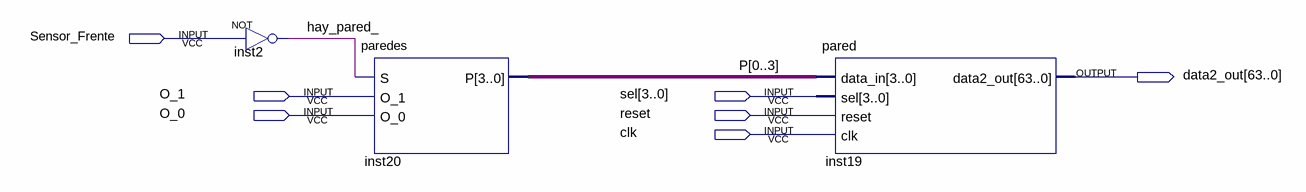
[diagram p0: schematic sheet]
// Quartus schematic pRUEBAFF.bdf as structural Verilog: 3 symbols, 7 pins
module pRUEBAFF (
  input  Sensor_Frente,
  input  O_1,
  input  [3:0] sel,
  input  O_0,
  input  reset,
  input  clk,
  output [63:0] data2_out
);

  wire hay_pared_;
  wire [3:0] P;

  not inst2 (hay_pared_, Sensor_Frente);
  paredes inst20 (.S(hay_pared_), .O_1(O_1), .O_0(O_0), .P({P[0], P[1], P[2], P[3]}));
  pared inst19 (.data_in({P[0], P[1], P[2], P[3]}), .sel(sel), .reset(reset), .clk(clk), .data2_out(data2_out));
endmodule
